# EAGLE design fpc_adapter (EAGLE 9.6.1)
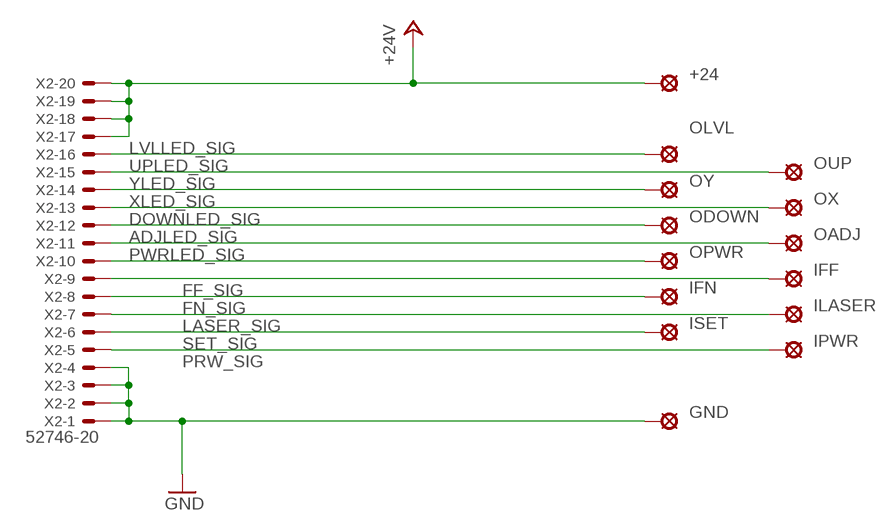
[diagram p0: schematic, sheet 1]

## Parts
+24  LSP10  [LSP10]
GND  LSP10  [LSP10]
IFF  LSP10  [LSP10]
IFN  LSP10  [LSP10]
ILASER  LSP10  [LSP10]
IPWR  LSP10  [LSP10]
ISET  LSP10  [LSP10]
OADJ  LSP10  [LSP10]
ODOWN  LSP10  [LSP10]
OLVL  LSP10  [LSP10]
OPWR  LSP10  [LSP10]
OUP  LSP10  [LSP10]
OX  LSP10  [LSP10]
OY  LSP10  [LSP10]
X2  52746-20  [52746-20]

## Nets
+24V: +24.MP X2.17 X2.18 X2.19 X2.20
ADJLED_SIG: OADJ.MP X2.11
DOWNLED_SIG: ODOWN.MP X2.12
FF_SIG: IFF.MP X2.9
FN_SIG: IFN.MP X2.8
GND [supply]: GND.MP X2.1 X2.2 X2.3 X2.4
LASER_SIG: ILASER.MP X2.7
LVLLED_SIG: OLVL.MP X2.16
PRW_SIG: IPWR.MP X2.5
PWRLED_SIG: OPWR.MP X2.10
SET_SIG: ISET.MP X2.6
UPLED_SIG: OUP.MP X2.15
XLED_SIG: OX.MP X2.13
YLED_SIG: OY.MP X2.14

## Library data of the parts
+24 GND IFF IFN ILASER IPWR ISET OADJ ODOWN OLVL OPWR OUP OX OY = solpad:LSP10: SOLDER PAD drill 1.0 mm, distributor Buerklin, 12H555
X2 = con-molex_user:52746-20: FPC Connector ZIF for SMT 0.5mm Source: http://www.farnell.com/datasheets/73044.pdf [DWG. NO. (Sheet 1 OF 2) SD-52746-**17] Distributor: Farnell 9786350; MF: MOLEX; OC_FARNELL: 9786350; OC_NEWARK: unknown

## Net classes
1 supply: width 0.254 mm, clearance 0.127 mm

## Board
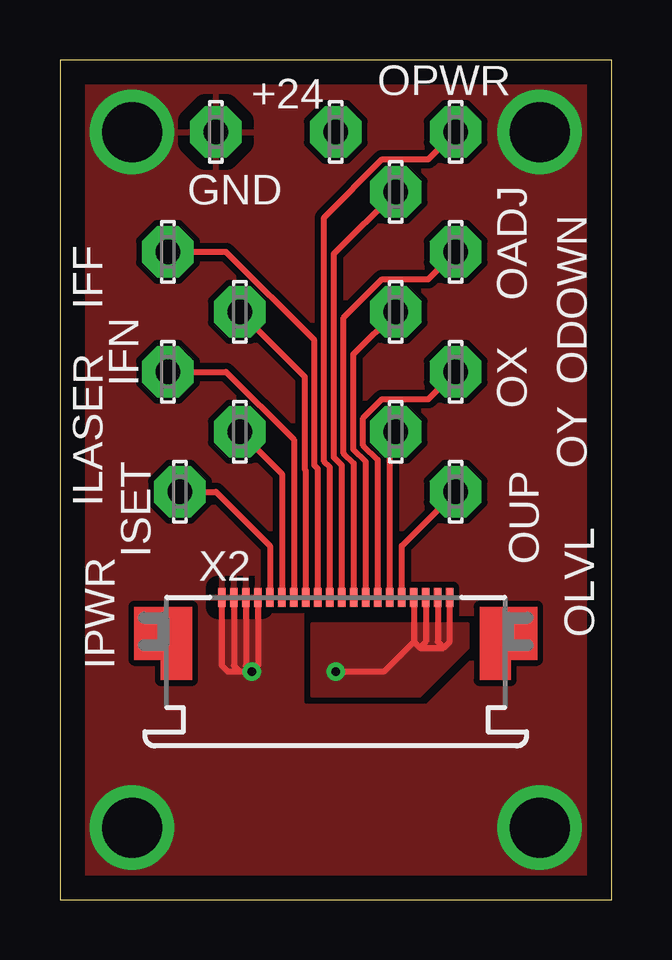
[diagram p1: board, top side]
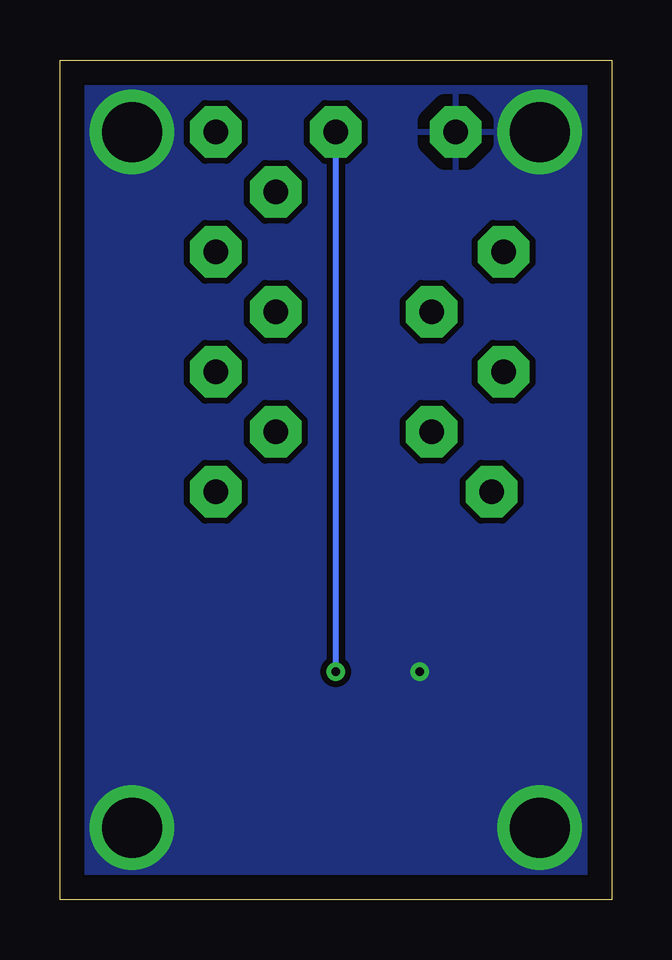
[diagram p2: board, bottom side, seen from below]

Size 23 x 35 mm. Coordinates in mm from the lower left corner, seen from the top.
Outline: 0,0 23,0 23,35 0,35 0,0
Copper layers (1*16): Top 0.035mm / dielectric 1.5mm / Bottom 0.035mm
Design rules "default *": minimum track width 6mil, minimum drill 0.35mm, track to track 6mil, track to pad 6mil, pad to pad 6mil, via to via 6mil, smd to smd 6mil, copper to edge 40mil, drill to drill 6mil, minimum pad ring 10mil, minimum via ring 8mil, stop-mask expansion 4mil, vias tented up to drill 0mil, thermal gap 20mil

### Footprints (pad centres in the part's own frame; a part is rotated, then mirrored left to right if it is on the bottom)
LSP10 = drill 1.016 pad 2.159 octagon: MP 0,0
52746-20 = smd 0.3 x 0.8: 1 -4.75,0.6; 2 -4.25,0.6; 3 -3.75,0.6; 4 -3.25,0.6; 5 -2.75,0.6; 6 -2.25,0.6; 7 -1.75,0.6; 8 -1.25,0.6; 9 -0.75,0.6; 10 -0.25,0.6; 11 0.25,0.6; 12 0.75,0.6; 13 1.25,0.6; 14 1.75,0.6; 15 2.25,0.6; 16 2.75,0.6; 17 3.25,0.6; 18 3.75,0.6; 19 4.25,0.6; 20 4.75,0.6

### Placement (x,y rotation side)
+24  11.5,32 90 top
GND  6.5,32 90 top
IFF  4.5,27 90 top
IFN  7.5,24.5 90 top
ILASER  4.5,22 90 top
IPWR  5,17 90 top
ISET  7.5,19.5 90 top
OADJ  14,29.5 270 top
ODOWN  16.5,27 270 top
OLVL  16.5,17 270 top
OPWR  16.5,32 270 top
OUP  14,19.5 270 top
OX  14,24.5 270 top
OY  16.5,22 270 top
X2  11.5,12 0 top

### Tracks (layer width: path | path; a pad name or v marks a point on that pad's centre or on a via)
+24V  (via drill 0.35)
  Top 0.254: X2.17 14.75,10.75 | 14.75,10.75 15,10.5 | 15,10.5 16,10.5 | 16,10.5 16.25,10.75 X2.20 | X2.19 15.75,10.75 16,10.5 | X2.18 15.25,10.75 15,10.5 | 14.75,10.75 13.5,9.5 v11.5,9.5
  Bottom 0.254: v11.5,9.5 +24.MP
  pour Top (isolate 0.254): 11,11.5 17,11.5 17,10.5 16.5,10 15,8.5 10.5,8.5 10.5,11.5
ADJLED_SIG
  Top 0.254: X2.11 11.75,18.1 11.42,18.43 11.42,26.92 OADJ.MP
DOWNLED_SIG
  Top 0.254: X2.12 12.25,18.18 11.83,18.6 11.83,24.25 13.44,25.86 15.36,25.86 ODOWN.MP
FF_SIG
  Top 0.254: X2.9 10.75,17.95 10.61,18.09 10.61,23.31 6.92,27 IFF.MP
FN_SIG
  Top 0.254: X2.8 10.25,17.88 10.2,17.93 10.2,21.8 IFN.MP
GND  (via drill 0.35, 2.5)
  Top 0.254: X2.4 8.25,9.75 v8,9.5 | X2.3 7.75,9.75 v8,9.5 | v8,9.5 7.5,9.5 | 7.5,9.5 7,9.5 6.75,9.75 X2.1 | X2.2 7.25,9.75 7.5,9.5
  other vias: 3,32 3,3 20,32 20,3
  pour Bottom (isolate 0.254): 0,35 0,0 23,0 23,35
  pour Top (isolate 0.254, rank 2): 0,35 0,0 23,0 23,35
LASER_SIG
  Top 0.254: ILASER.MP 6.92,22 9.75,19.17 X2.7
LVLLED_SIG
  Top 0.254: X2.16 14.25,14.75 OLVL.MP
PRW_SIG
  Top 0.254: X2.5 8.75,14.75 6.5,17 IPWR.MP
PWRLED_SIG
  Top 0.254: X2.10 11.25,18.03 11.02,18.26 11.02,28.44 13.44,30.86 15.36,30.86 OPWR.MP
SET_SIG
  Top 0.254: ISET.MP 9.25,17.75 X2.6
UPLED_SIG
  Top 0.254: X2.15 13.75,19.25 OUP.MP
XLED_SIG
  Top 0.254: X2.13 12.75,18.25 12.23,18.77 12.23,22.73 OX.MP
YLED_SIG
  Top 0.254: X2.14 13.25,18.33 12.64,18.94 12.64,20.06 13.44,20.86 15.36,20.86 OY.MP